# EAGLE design PuggleBOB (EAGLE 6.4)
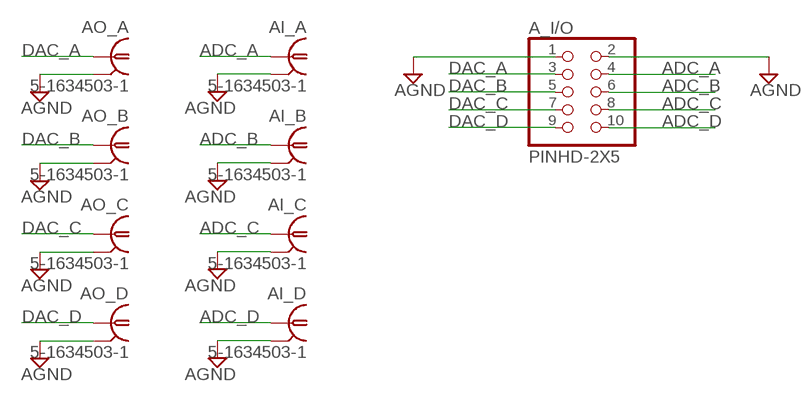
[diagram p0: schematic, sheet 1]

## Parts
A_I/O  PINHD-2X5  [2X05]
AI_A  5-1634503-1  BN35N61  [B35N61]
AI_B  5-1634503-1  BN35N61  [B35N61]
AI_C  5-1634503-1  BN35N61  [B35N61]
AI_D  5-1634503-1  BN35N61  [B35N61]
AO_A  5-1634503-1  BN35N61  [B35N61]
AO_B  5-1634503-1  BN35N61  [B35N61]
AO_C  5-1634503-1  BN35N61  [B35N61]
AO_D  5-1634503-1  BN35N61  [B35N61]

## Nets
ADC_A: A_I/O.4 AI_A.1
ADC_B: A_I/O.6 AI_B.1
ADC_C: A_I/O.8 AI_C.1
ADC_D: A_I/O.10 AI_D.1
AGND: A_I/O.1 A_I/O.2 AI_A.2 AI_A.3 AI_A.4 AI_A.5 AI_B.2 AI_B.3 AI_B.4 AI_B.5 AI_C.2 AI_C.3 AI_C.4 AI_C.5 AI_D.2 AI_D.3 AI_D.4 AI_D.5 AO_A.2 AO_A.3 AO_A.4 AO_A.5 AO_B.2 AO_B.3 AO_B.4 AO_B.5 AO_C.2 AO_C.3 AO_C.4 AO_C.5 AO_D.2 AO_D.3 AO_D.4 AO_D.5
DAC_A: A_I/O.3 AO_A.1
DAC_B: A_I/O.5 AO_B.1
DAC_C: A_I/O.7 AO_C.1
DAC_D: A_I/O.9 AO_D.1

## Library data of the parts
A_I/O = adafruit:PINHD-2X5
AI_A AI_B AI_C AI_D AO_A AO_B AO_C AO_D = con-coax:BN35N61: BNC CONNECTOR M/A COM www.macom.com distributor Farnell 149-452; OC_FARNELL: unknown; OC_NEWARK: unknown

## Board
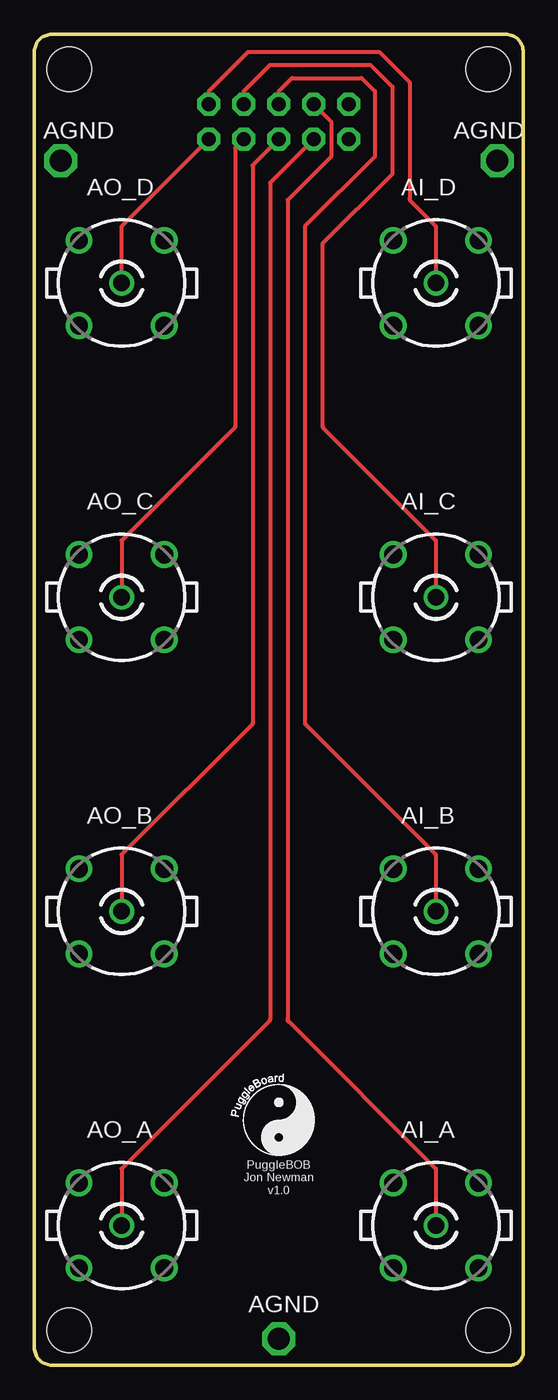
[diagram p1: board, top side]
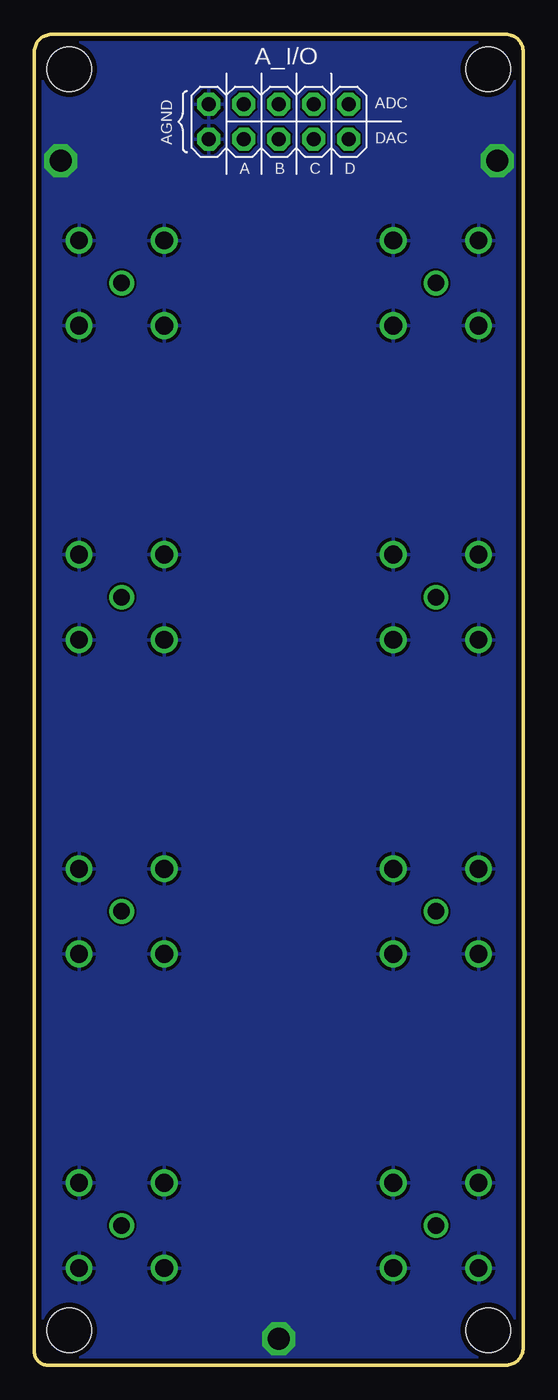
[diagram p2: board, bottom side, seen from below]

Size 35.56 x 96.84 mm. Coordinates in mm from the lower left corner, seen from the top.
Outline: 35.56,95.57 35.56,0.95 arc-90 34.61,0 1.27,0 arc-90 0,1.27 0,95.57 arc-90 1.27,96.84 34.29,96.84 arc-90 35.56,95.57
Copper layers (1*16): Top 0.0356mm / dielectric 1.5011mm / Bottom 0.0356mm
Design rules "LaenPCBOrder": minimum track width 6mil, minimum drill 13mil, track to track 6mil, track to pad 6mil, pad to pad 6mil, via to via 6mil, smd to smd 6mil, copper to edge 15mil, drill to drill 6mil, minimum pad ring 7mil, minimum via ring 7mil, stop-mask expansion 4mil, vias tented up to drill 0mil, thermal gap 10mil
Holes 3.26 mm at 2.54,94.3 33.02,94.3 33.02,2.54 2.54,2.54

### Footprints (pad centres in the part's own frame; a part is rotated, then mirrored left to right if it is on the bottom)
2X05 = drill 1.016 pad 1.676 octagon: 1 -5.08,-1.27; 2 -5.08,1.27; 3 -2.54,-1.27; 4 -2.54,1.27; 5 0,-1.27; 6 0,1.27; 7 2.54,-1.27; 8 2.54,1.27; 9 5.08,-1.27; 10 5.08,1.27
B35N61 = drill 1.2: 1 0,0 | drill 1.3: 2 3.099,3.099; 3 -3.099,3.099; 4 -3.099,-3.099; 5 3.099,-3.099

### Placement (x,y rotation side)
A_I/O  17.78,90.49 0 bottom
AI_A  29.21,10.16 0 top
AI_B  29.21,33.02 0 top
AI_C  29.21,55.88 0 top
AI_D  29.21,78.74 0 top
AO_A  6.35,10.16 0 top
AO_B  6.35,33.02 0 top
AO_C  6.35,55.88 0 top
AO_D  6.35,78.74 0 top

### Tracks (layer width: path | path; a pad name or v marks a point on that pad's centre or on a via)
ADC_A
  Top 0.305: A_I/O.4 21.59,90.49 21.59,87.95 18.41,84.77 18.41,25.19 arc45 18.49,25.01 29.21,14.29 AI_A.1
ADC_B
  Top 0.305: A_I/O.6 17.78,92.71 18.73,93.66 23.81,93.66 24.77,92.71 24.77,87.95 19.68,82.87 19.68,46.78 arc45 19.76,46.6 29.21,37.15 AI_B.1
ADC_C
  Top 0.305: A_I/O.8 15.24,92.71 17.14,94.61 24.45,94.61 26.04,93.03 26.04,86.68 20.95,81.6 20.95,68.37 arc45 21.03,68.19 29.21,60.01 AI_C.1
ADC_D
  Top 0.305: A_I/O.10 12.7,92.71 15.56,95.57 25.08,95.57 27.3,93.34 27.3,84.88 arc45 27.38,84.7 29.21,82.87 AI_D.1
AGND  (via drill 1.6)
  other vias: 1.91,87.63 33.66,87.63 17.78,1.91
  pour Bottom: 0,96.84 35.56,96.84 35.56,0 0,0
DAC_A
  Top 0.305: A_I/O.3 17.14,86.04 17.14,25.19 arc-45 17.07,25.01 6.35,14.29 AO_A.1
DAC_B
  Top 0.305: A_I/O.5 15.88,87.31 15.88,46.67 6.35,37.15 AO_B.1
DAC_C
  Top 0.305: A_I/O.7 14.61,88.58 14.61,68.26 6.35,60.01 AO_C.1
DAC_D
  Top 0.305: AO_D.1 6.35,82.87 A_I/O.9

### Text on the board
tPlace: AGND | AGND | PuggleBOB / Jon Newman / v1.0 | AGND
bPlace: AGND | ADC | DAC | D | C | B | A